# Altium project ProjectPI_STM32.PrjPcb
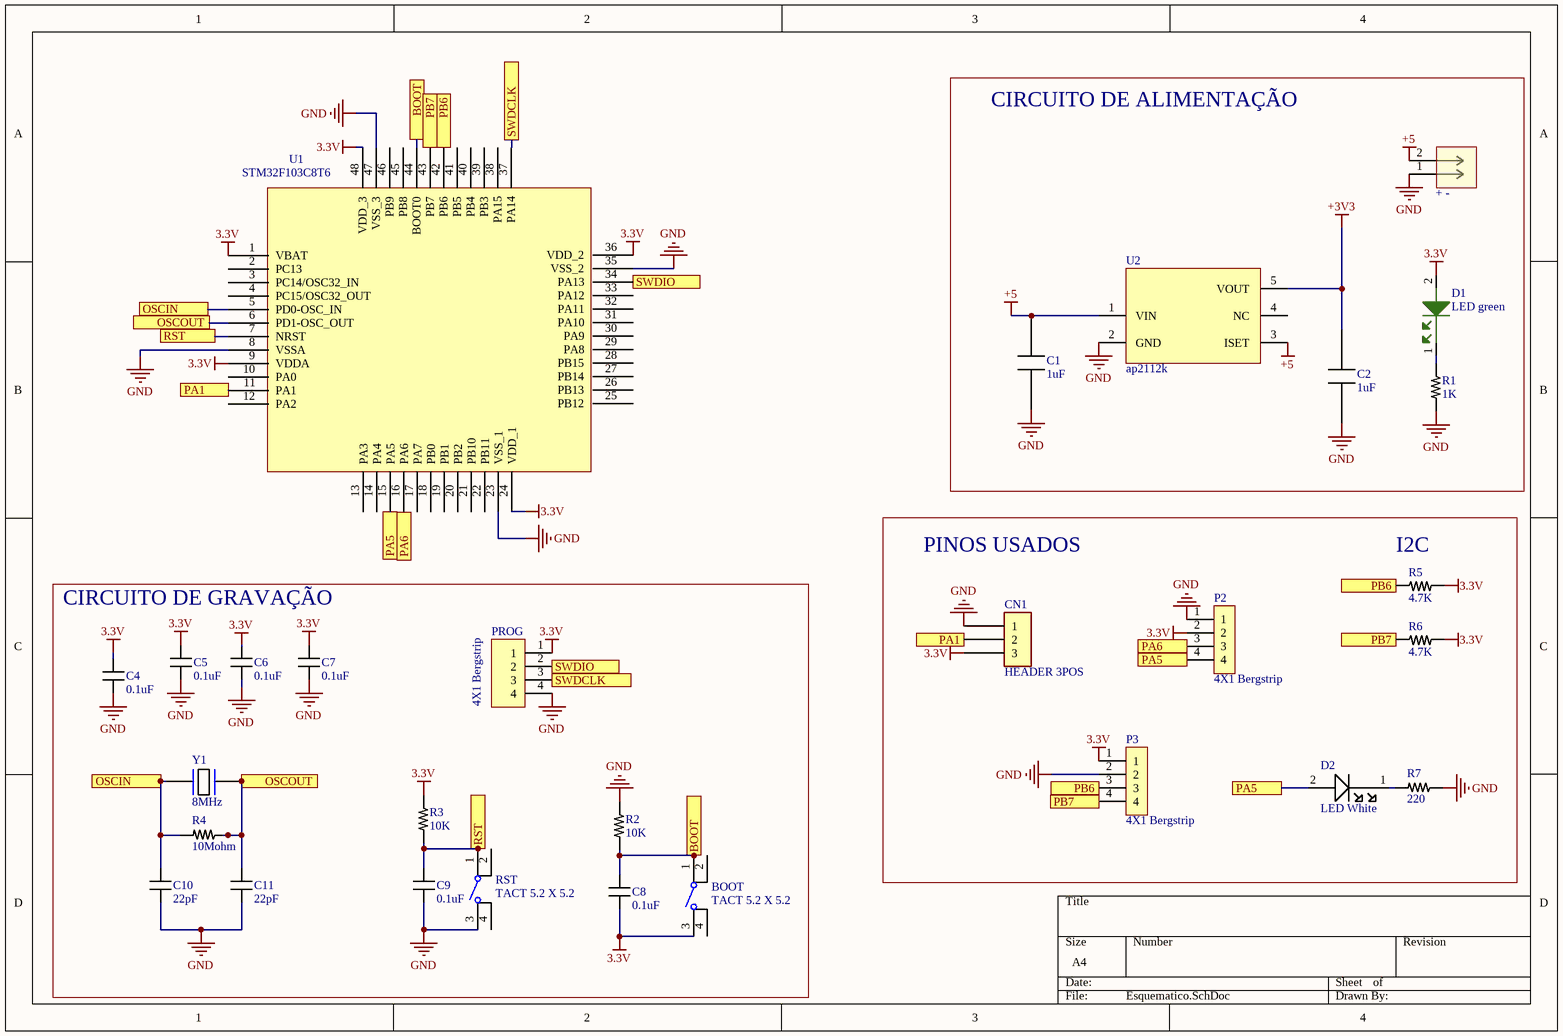
[diagram p0: Esquematico.SchDoc]
1 sheet, 29 parts. Net scope: flat (ports and power ports of the same name join across sheets).
Board file: PCB1.PcbDoc

## Sheet Esquematico.SchDoc
size A4; SheetNumber: 1; SheetTotal: 1

### Parts
+_-  Header 2x1  [HDR1X2]  (value not drawn)
BOOT  TACT 5.2 X 5.2  [TACT 5.2 X 5.2, 1.5mm, 160gf]
C1  1uF  [C_SMD_0603]
C2  1uF  [C_SMD_0603]
C4  0.1uF  [C_SMD_0603]
C5  0.1uF  [C_SMD_0603]
C6  0.1uF  [C_SMD_0603]
C7  0.1uF  [C_SMD_0603]
C8  0.1uF  [C_SMD_0603]
C9  0.1uF  [C_SMD_0603]
C10  22pF  [C_SMD_0603]
C11  22pF  [C_SMD_0603]
CN1  HEADER 3POS  [HDR1X3]
D1  LED green  [LED_0805_GREEN]
D2  LED White  [LED_WHITE]
P2  4X1 Bergstrip  [CON4_100_40D72_TH_ST_MALE]
P3  4X1 Bergstrip  [CON4_100_40D72_TH_ST_MALE]
PROG  4X1 Bergstrip  [CON4_100_40D72_TH_ST_MALE]
R1  1K  [R_SMD_0603]
R2  10K  [R_SMD_0603]
R3  10K  [R_SMD_0603]
R4  10Mohm  [R_SMD_0603]
R5  4.7K  [R_SMD_0603]
R6  4.7K  [R_SMD_0603]
R7  220  [R_SMD_0603]
RST  TACT 5.2 X 5.2  [TACT 5.2 X 5.2, 1.5mm, 160gf]
U1  STM32F103C8T6  [STM32F103C8T6]
U2  ap2112k  [SOT23 5]
Y1  8MHz  [XTAL_CRISTAL]

### Blocks framed on the sheet
CIRCUITO DE ALIMENTAÇÃO: +_- C1 C2 D1 R1 U2
CIRCUITO DE GRAVAÇÃO: BOOT C4-C11 PROG R2-R4 RST Y1

### Ports
BOOT (see Esquematico[2A]), BOOT (see Esquematico[2D]), OSCIN (see Esquematico[1B]), OSCIN (see Esquematico[1D]), OSCOUT (see Esquematico[1B]), OSCOUT (see Esquematico[1D]), PA1 (see Esquematico[1B]), PA1 (see Esquematico[3C]), PA5 (see Esquematico[1C], Esquematico[3C]), PA5 (see Esquematico[1C], Esquematico[4D]), PA5 (see Esquematico[3C], Esquematico[4D]), PA6 (see Esquematico[2C]), PA6 (see Esquematico[3C]), PB6, PB6 (see Esquematico[2A], Esquematico[3D]), PB6 (see Esquematico[3D], Esquematico[4C]), PB7 (see Esquematico[2A], Esquematico[3D]), PB7 (see Esquematico[2A], Esquematico[4C]), PB7 (see Esquematico[3D], Esquematico[4C]), RST (see Esquematico[1B]), RST (see Esquematico[2D]), SWDCLK (see Esquematico[2A]), SWDCLK (see Esquematico[2C]), SWDIO (see Esquematico[2B]), SWDIO (see Esquematico[2C])

### Nets
3.3V: BOOT.3 C4.2 C5.2 C6.2 C7.2 C8.1 CN1.3 D1.2 P2.2 P3.1 PROG.1 R3.2 R5.1 R6.1 U1.1(VBAT) U1.9(VDDA) U1.24(VDD_1) U1.36(VDD_2) U1.48(VDD_3)
+3V3: C2.2 U2.5(VOUT)
+5: +_-.2 C1.2 U2.1(VIN) U2.3(ISET)
GND: +_-.1 C1.1 C2.1 C4.1 C5.1 C6.1 C7.1 C9.1 C10.1 C11.1 CN1.1 P2.1 P3.2 PROG.4 R1.1 R2.2 R7.2 RST.3 U1.8(VSSA) U1.23(VSS_1) U1.35(VSS_2) U1.47(VSS_3) U2.2(GND)
NetBOOT_1: BOOT.1 C8.2 R2.1 U1.44(BOOT0) ; port BOOT
NetC9_2: C9.2 R3.1 RST.1 U1.7(NRST) ; port RST
NetC10_2: C10.2 R4.1 U1.5(PD0-OSC_IN) Y1.1 ; port OSCIN
NetC11_2: C11.2 R4.2 U1.6(PD1-OSC_OUT) Y1.2 ; port OSCOUT
NetCN1_2: CN1.2 U1.11(PA1) ; port PA1
NetD1_1: D1.1 R1.2
NetD2_1: D2.1 R7.1
NetD2_2: D2.2 P2.4 U1.15(PA5) ; port PA5
NetP2_3: P2.3 U1.16(PA6) ; port PA6
NetP3_3: P3.3 R5.2 U1.42(PB6) ; port PB6
NetP3_4: P3.4 R6.2 U1.43(PB7) ; port PB7
NetPROG_2: PROG.2 U1.34(PA13) ; port SWDIO
NetPROG_3: PROG.3 U1.37(PA14) ; port SWDCLK

Not connected (* = marked no-connect by the designer): BOOT 2 4; RST 2 4; U1 2(PC13) 3(PC14/OSC32_IN) 4(PC15/OSC32_OUT) 10(PA0) 12(PA2) 13(PA3) 14(PA4) 17(PA7) 18(PB0) 19(PB1) 20(PB2) 21(PB10) 22(PB11) 25(PB12) 26(PB13) 27(PB14) 28(PB15) 29(PA8) 30(PA9) 31(PA10) 32(PA11) 33(PA12) 38(PA15) 39(PB3) 40(PB4) 41(PB5) 45(PB8) 46(PB9); U2 4(NC)

### Notes on the sheet
- PINOS USADOS
- (near R5) I2C

### Library data of the parts
+_- = HDR1X2: Mfr_Name: Wurth Electronics; RefDes: RefDes; Type: Type
BOOT RST = TACT 5.2 X 5.2, 1.5 MM H, 260GF,: Interruptor tátil SPST-NA Top atuado Montagem em superfície; Part Number: PTS526 SK15 SMTR2 LFS; Item: TACT 5.2 X 5.2, 1.5 MM H, 260GF,; ComponentLink1Description: New link; ComponentLink1URL: https://www.digikey.com.br/pt/products/detail/c-k/PTS526-SK15-SMTR2-LFS/10056626; Endereço Gaveteiro: *
C1 C2 = C_SMD_0603
C4-C9 = CAP_0.1uF-50V-5%-0603: 0.1µF ±5% 50V Ceramic Capacitor X7R 0603; Manufacturer: KEMET; Manufacturing Part Number: C0805C104J5RACTU; Case/Package: 0603; Supplier-1: Digikey; Supplier Part Number-1: 399-1171-1-ND
C10 C11 = CAP_22pF-50V-5%0603: 22pF ±5% 50V Ceramic Capacitor C0G, NP0 0603; Manufacturer: KEMET; Manufacturer Part Number: C0805C220J5GACTU; Case/Package: 0603; Supplier-1: Digikey; Supplier Part Number-1: 399-1113-1-ND
CN1 = HEADER_1X3: Conector barra de pinos Furo passante, 3 posições (2,54mm); Item: HEADER MACHO 3POS
D1 = LED_0805_GREEN: WL-SMCD SMT Mono-color Chip LED Diffused; Manufacturer: Wurth Electronics; Manufacturer Part Number: 150060VS55040; Lens Style: Flat; Luminous Intensity: 60mcd; Forward Voltage: 2V; Test Current: 20mA; Viewing Angle: 140°; Dominant Wavelength: 573nm; Forward Current: 40mA; Max Reverse Voltage (DC): 5V; Power Dissipation: 48mW; Lens Size: 0.8mm; Encapsulamento: 0603 SMD; Supplier 1: Digikey; RoHS: Yes; Category: LEDs; Stock 1: 10387; Pricing 1: 1=0,19, 10=0,173, 100=0,157, 500=0,141, 1000=0,125 (USD); Mount: Surface Mount; Case/Package: 0603; Color: Green; Case Code (Imperial): 0603; Case Code (Metric): 1608; Min Operating Temperature: -40°C; Max Operating Temperature: 85°C; Packaging: Cut Tape; Lens Transparency: Diffused; Series: WL-SMDC; Reverse Voltage: 5V; Wavelength: 573nm; Length: 1.6mm; Width: 0.8mm; Height: 0.5mm; RoHS Compliant: Yes; ComponentLink1URL: http://www.farnell.com/datasheets/2621647.pdf?src-supplier=Farnell; ComponentLink1Description: http://www.farnell.com/datasheets/2621647.pdf?src-supplier=Farnell; ComponentLink2URL: https://www.we-online.de/web/en/index.php/download/media/07_electronic_components/download_center_1/application_notes_berichte/ano002_leds___the_future_of_horticultural_lighting/ANO002b_EN_LEDs_The_Future_of_Horticultural_Lighting.pdf?src-supplier=Digikey; ComponentLink2Description: https://www.we-online.de/web/en/index.php/download/media/07_electronic_components/download_center_1/application_notes_berichte/ano002_leds___the_future_of_horticultural_lighting/ANO002b_EN_LEDs_The_Future_of_Horticultural_Lighting.pdf?src-supplier=Digikey; ComponentLink3URL: https://katalog.we-online.de/pbs/datasheet/150060VS55040.pdf?src-supplier=Digikey; ComponentLink3Description: https://katalog.we-online.de/pbs/datasheet/150060VS55040.pdf?src-supplier=Digikey; ComponentLink4URL: http://www.farnell.com/datasheets/2621647.pdf?src-supplier=Element14; ComponentLink4Description: http://www.farnell.com/datasheets/2621647.pdf?src-supplier=Element14; ComponentLink5URL: http://www.farnell.com/datasheets/2621647.pdf?src-supplier=Newark; ComponentLink5Description: http://www.farnell.com/datasheets/2621647.pdf?src-supplier=Newark; Supplier Part Number 1: 732-12017-1-ND
D2 = LED_WHITE: WL-SMCD SMT Mono-color Chip LED Diffused; Manufacturer: Wurth Electronics; Manufacturer Part Number: 150060VS55040; Color: Green; Lens Style: Flat; Luminous Intensity: 60mcd; Forward Voltage: 2V; Test Current: 20mA; Viewing Angle: 140°; Dominant Wavelength: 573nm; Forward Current: 40mA; Max Reverse Voltage (DC): 5V; Power Dissipation: 48mW; Lens Size: 0.8mm; Encapsulamento: 0603 SMD; Supplier 1: Digikey; RoHS: Yes; Category: LEDs; Stock 1: 10387; Pricing 1: 1=0,19, 10=0,173, 100=0,157, 500=0,141, 1000=0,125 (USD); Mount: Surface Mount; Case/Package: 0603; Case Code (Imperial): 0603; Case Code (Metric): 1608; Min Operating Temperature: -40°C; Max Operating Temperature: 85°C; Packaging: Cut Tape; Lens Transparency: Diffused; Series: WL-SMDC; Reverse Voltage: 5V; Wavelength: 573nm; Length: 1.6mm; Width: 0.8mm; Height: 0.5mm; RoHS Compliant: Yes; Supplier Part Number 1: 732-12017-1-ND
P2 P3 PROG = HEADER_4X1: 4 pin, 1 row, 2.54mm pitch bergstrip; Manufacturer: NA; Manufacturing Part Number: NA; Case/Package: TH; Supplier-1: NA; Supplier Part Number-1: NA
R1 = RES_1K-0.125W-1%-0603: 1 kOhms ±1% 0.125W, 1/8W Chip Resisto 0603; Manufacturer: 垈㎵á; Manufacturer Part Number: RC0805FR-071KL; Case/Package: 0603; Supplier-1: Digikey; Supplier Part Number-1: 311-1.00KCRCT-ND
R2 R3 R5-R7 = RES_10K-0.125W-1%-0603: 10 kOhms ±1% 0.125W, 1/8W Chip Resistor 0603; Manufacturer: Yageo; Manufacturing Part Number: RC0805FR-0710KL; Case/Package: 0603; Supplier-1: Digikey; Supplier Part Number-1: 311-10.0KCRCT-ND
R4 = RES_10MOHM-0.125W-1%-0603: 10 MOhms ±1% 0.125W, 1/8W Chip Resistor 0603; Manufacturer: Rohm Semiconductor; Manufacturing Part Number: KTR10EZPF1005; Case/Package: 0603; Supplier-1: Digikey; Supplier Part Number-1: RHM10.0MAHCT-ND
U1 = IC-STM32F103C8T6 _1: ARM® Cortex®-M3 STM32F1 Microcontroller IC 32-Bit 72MHz 64KB (64K x 8) FLASH; Manufacturer: STMicroelectronics; Manufacturer Part Number: STM32F103C8T6; Case/Package: 48-LQFP; Supplier-1: Digikey; Supplier Part Number-1: 497-6063-ND
U2 = ap2112k: IC REG LINEAR 3.3V 600MA SOT-25; Item: AP2112K-3.3TRG1; Part Number: AP2112K-3.3TRG1; Endereço gaveteiro: *; ComponentLink1Description: New link; ComponentLink1URL: https://www.digikey.com.br/pt/products/detail/diodes-incorporated/AP2112K-3-3TRG1/4470746
Y1 = XTAL_8MHZ-LFXTAL030234: Crystals 8MHz 22pF -20C 70C; Manufacturer: IQD Frequency Products; Manufacturing Part Number: LFXTAL030234Reel; Case/Package: SMD; Supplier-1: Mouser; Supplier Part Number-1: 449-LFXTAL030234REEL